# EAGLE design kuramoto6 (EAGLE 6.1)
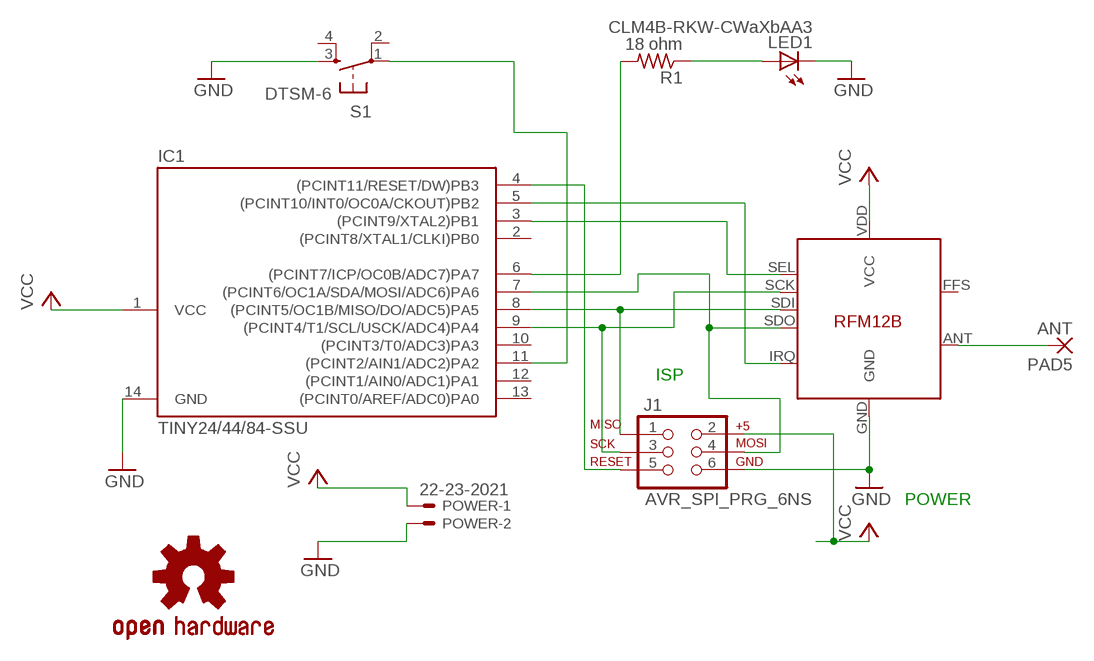
[diagram p0: schematic, sheet 1]

## Parts
IC1  TINY24/44/84-SSU  [SOIC14]
J1  AVR_SPI_PRG_6NS  [2X3-NS]
LED1  CLM4B-RKW-CWaXbAA3  LEDP-LCC-4  [P-LCC-4]
PAD5  ANT  WIREPAD2,54/1,0  [2,54/1,0]
POWER  22-23-2021  [22-23-2021]
R1  18 ohm  R-US_R0805  [R0805]
RFM12B  RFM12BN  [RFM12B-NARROW]
S1  DTSM-6  [DTSM-6]
U$1  OSHW-LOGOS  [OSHW-LOGO-S]

## Nets
GND: IC1.14(GND) J1.6 LED1.C@4(C) POWER.2 RFM12B.GND S1.3
N$1: LED1.A R1.1
N$2: IC1.9((PCINT4/T1/SCL/USCK/ADC4)PA4) J1.3 RFM12B.SCK
N$3: IC1.8((PCINT5/OC1B/MISO/DO/ADC5)PA5) J1.1 RFM12B.SDI
N$4: IC1.7((PCINT6/OC1A/SDA/MOSI/ADC6)PA6) J1.4 RFM12B.SDO
N$5: IC1.3((PCINT9/XTAL2)PB1) RFM12B.SEL
N$6: IC1.6((PCINT7/ICP/OC0B/ADC7)PA7) R1.2
N$7: IC1.5((PCINT10/INT0/OC0A/CKOUT)PB2) RFM12B.IRQ
N$8: PAD5.1(P) RFM12B.ANT
N$10: IC1.11((PCINT2/AIN1/ADC2)PA2) S1.1
N$14: IC1.4((PCINT11/RESET/DW)PB3) J1.5
VCC: IC1.1(VCC) J1.2 POWER.1 RFM12B.VDD(VCC)
Unconnected: IC1.2((PCINT8/XTAL1/CLKI)PB0) IC1.10((PCINT3/T0/ADC3)PA3) IC1.12((PCINT1/AIN0/ADC1)PA1) IC1.13((PCINT0/AREF/ADC0)PA0) RFM12B.FFS S1.2 S1.4

## Notes on the sheet
- ISP
- POWER

## Library data of the parts
IC1 = avr-7:TINY24/44/84
J1 = SparkFun-Connectors:AVR_SPI_PRG_6: AVR ISP 6 Pin This is the reduced ISP connector for AVR programming. Common on Arduino. This footprint will take up less PCB space and can be used with a 10-pin to 6-pin adapter such as SKU: BOB-08508
LED1 = led:LED: LED OSRAM: - CHIPLED LG R971, LG N971, LY N971, LG Q971, LY Q971, LO R971, LY R971 LH N974, LH R974 LS Q976, LO Q976, LY Q976 LO Q996 - Hyper CHIPLED LW Q18S LB Q993, LB Q99A, LB R99A - SideLED LS A670, LO A670, LY A670, LG A670, LP A670 LB A673, LV A673, LT A673, LW A673 LH A674 LY A675 LS A676, LA A676, LO A676, LY A676, LW A676 LS A679, LY A679, LG A679 - Hyper Micro SIDELED® LS Y876, LA Y876, LO Y876, LY Y876 LT Y87S - SmartLED LW L88C, LW L88S LB L89C, LB L89S, LG L890 LS L89K, LO L89K, LY L89K LS L896, LA L896, LO L896, LY L896 - TOPLED LS T670, LO T670, LY T670, LG T670, LP T670 LSG T670, LSP T670, LSY T670, LOP T670, LYG T670 LG T671, LOG T671, LSG T671 LB T673, LV T673, LT T673, LW T673 LH T674 LS T676, LA T676, LO T676, LY T676, LB T676, LH T676, LSB T676, LW T676 LB T67C, LV T67C, LT T67C, LS T67K, LO T67K, LY T67K, LW E67C LS E67B, LA E67B, LO E67B, LY E67B, LB E67C, LV E67C, LT E67C LW T67C LS T679, LY T679, LG T679 LS T770, LO T770, LY T770, LG T770, LP T770 LB T773, LV T773, LT T773, LW T773 LH T774 LS E675, LA E675, LY E675, LS T675 LS T776, LA T776, LO T776, LY T776, LB T776 LHGB T686 LT T68C, LB T68C - Hyper Mini TOPLED® LB M676 - Mini TOPLED Santana® LG M470 LS M47K, LO M47K, LY M47K Source: http://www.osram.convergy.de LUXEON: - LUMILED® LXK2-PW12-R00, LXK2-PW12-S00, LXK2-PW14-U00, LXK2-PW14-V00 LXK2-PM12-R00, LXK2-PM12-S00, LXK2-PM14-U00 LXK2-PE12-Q00, LXK2-PE12-R00, LXK2-PE12-S00, LXK2-PE14-T00, LXK2-PE14-U00 LXK2-PB12-K00, LXK2-PB12-L00, LXK2-PB12-M00, LXK2-PB14-N00, LXK2-PB14-P00, LXK2-PB14-Q00 LXK2-PR12-L00, LXK2-PR12-M00, LXK2-PR14-Q00, LXK2-PR14-R00 LXK2-PD12-Q00, LXK2-PD12-R00, LXK2-PD12-S00 LXK2-PH12-R00, LXK2-PH12-S00 LXK2-PL12-P00, LXK2-PL12-Q00, LXK2-PL12-R00 Source: www.luxeon.com KINGBRIGHT: KA-3528ASYC Source: www.kingbright.com
PAD5 = wirepad:WIREPAD: Wire PAD connect wire on PCB
POWER = con-molex:22-23-2021: .100" (2.54mm) Center Header - 2 Pin; MF: MOLEX; MPN: 22-23-2021; OC_FARNELL: 1462926; OC_NEWARK: 25C3832
R1 = resistor:R-US_: RESISTOR, American symbol
RFM12B = JeeLabs:RFM12B
S1 = switch-tact:DTSM-6
U$1 = sfe-aesthetics:OSHW-LOGO: Open Source Hardware Logo This logo indicates the piece of hardware it is found on incorporates a OSHW license and/or adheres to the definition of open source hardware found here: http://freedomdefined.org/OSHW

## Board
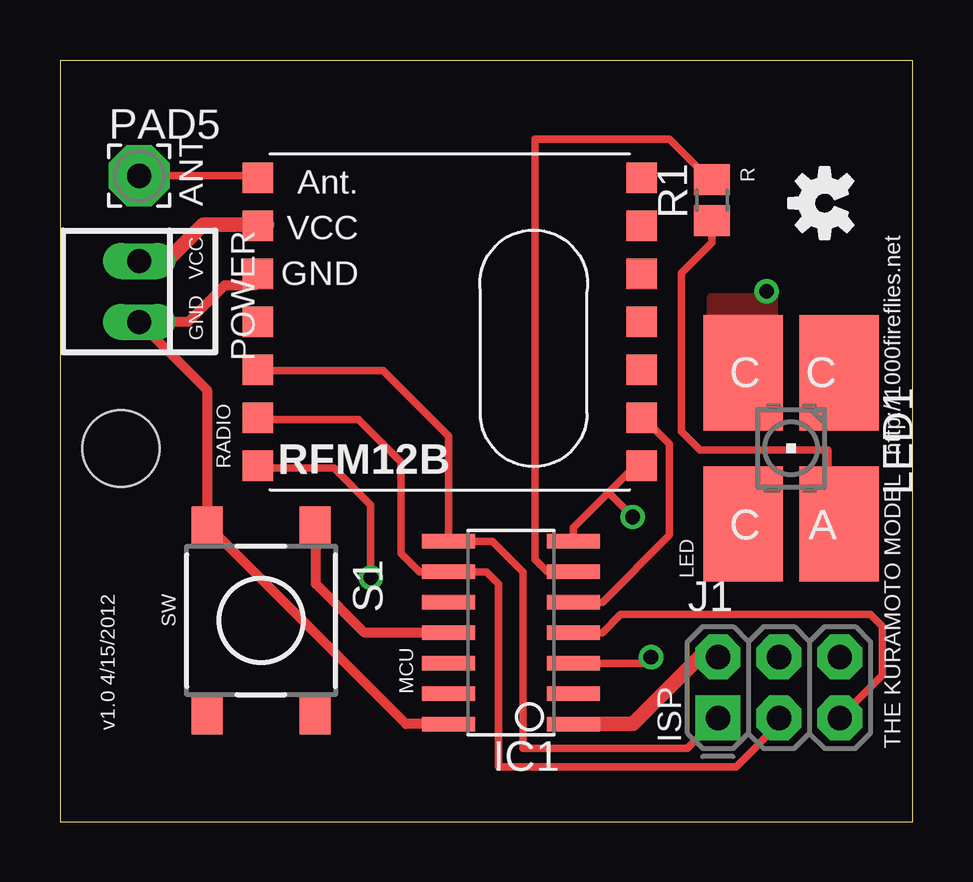
[diagram p1: board, top side]
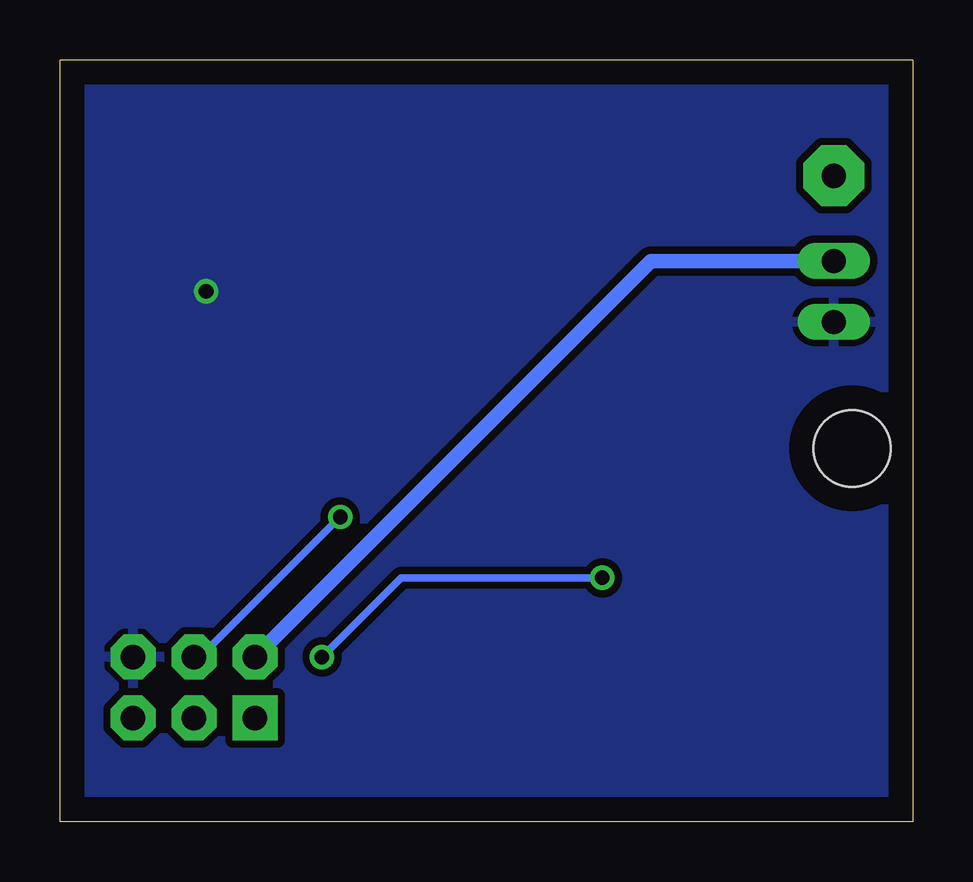
[diagram p2: board, bottom side, seen from below]

Size 35.56 x 31.75 mm. Coordinates in mm from the lower left corner, seen from the top.
Outline: 0,0 35.56,0 35.56,31.75 0,31.75 0,0
Copper layers (1*16): Top 0.035mm / dielectric 1.5mm / Bottom 0.035mm
Design rules: minimum track width 12mil, minimum drill 24mil, track to track 12mil, track to pad 12mil, pad to pad 12mil, via to via 12mil, smd to smd 8mil, copper to edge 40mil, drill to drill 8mil, minimum pad ring 10mil, minimum via ring 8mil, stop-mask expansion 4mil, vias tented up to drill 0mil, thermal gap 10mil
Holes 3.2 mm at 2.54,15.56
tKeepout: area 0,0 to 35.6,3.3; area 0,28.4 to 35.6,31.8

### Footprints (pad centres in the part's own frame; a part is rotated, then mirrored left to right if it is on the bottom)
SOIC14 = smd 0.61 x 2.21: 1 -3.81,-2.603; 2 -2.54,-2.603; 3 -1.27,-2.603; 4 0,-2.603; 5 1.27,-2.603; 6 2.54,-2.603; 7 3.81,-2.603; 8 3.81,2.603; 9 2.54,2.603; 10 1.27,2.603; 11 0,2.603; 12 -1.27,2.603; 13 -2.54,2.603; 14 -3.81,2.603
2X3-NS = drill 1.016 pad 1.88 square: 1 -2.54,-1.27 | drill 1.016 pad 1.88 octagon: 2 -2.54,1.27; 3 0,-1.27; 4 0,1.27; 5 2.54,-1.27; 6 2.54,1.27
P-LCC-4 = smd 3.3 x 4.8: A -2,3.15; C@1 -2,-3.15; C@3 2,3.15; C@4 2,-3.15
2,54/1,0 = drill 1.016 pad 2.54 octagon: 1 0,0
22-23-2021 = drill 1 long: 1 -1.27,0; 2 1.27,0
R0805 = smd 1.3 x 1.5: 1 -0.85,0; 2 0.85,0
RFM12B-NARROW = smd 1.27 x 1.27: ANT 8,-6; FFS -8,2; GND 8,-2; IRQ -8,4; P$8 -8,0; P$9 -8,-2; P$10 -8,-4; P$12 -8,-6; P$16 8,0; SCK 8,4; SDI 8,2; SDO -8,6; SEL 8,6; VDD 8,-4
DTSM-6 = smd 1.55 x 1.3: 1 -3.975,2.25; 2 3.975,2.25; 3 -3.975,-2.25; 4 3.975,-2.25

### Placement (x,y rotation side)
IC1  18.8,7.87 90 top
J1  29.97,5.59 0 top
LED1  30.48,15.56 180 top
PAD5  3.3,26.92 0 top
POWER  3.3,22.1 270 top
R1  27.18,25.91 90 top
RFM12B  16.26,20.83 180 top
S1  8.38,8.38 270 top
U$1  31.88,25.78 90 top

### Tracks (layer width: path | path; a pad name or v marks a point on that pad's centre or on a via)
GND  (via drill 0.61)
  Top 0.305: 8.64,22.86 RFM12B.GND 8.13,22.35 | v29.46,22.1 29.46,21.84 29.72,21.84
  Top 0.406: POWER.2 3.68,20.45 | 3.68,20.45 6.13,18 S1.3 14.43,4.06 IC1.14 | 8.13,22.35 6.86,22.35 5.33,20.83 4.06,20.83 3.68,20.45
  pour Bottom: 0.51,0.51 35.05,0.51 35.05,31.24 0.51,31.24
  pour Top (no thermals): 27.18,21.84 29.72,21.84 29.72,20.32 27.18,20.32
N$1
  Top 0.305: LED1.A 32,12.7 32,15.49 26.67,15.49 25.91,16.26 25.91,22.86 27.18,24.13 R1.1
N$2
  Top 0.305: RFM12B.SCK 8.64,16.76 12.45,16.76 14.22,14.99 14.22,11.18 14.99,10.41 IC1.9 17.78,10.41 18.29,9.91 18.29,2.29 28.19,2.29 29.97,4.06 J1.3
N$3
  Top 0.305: J1.1 26.16,3.05 19.3,3.05 19.3,10.41 18.03,11.68 IC1.8 16.19,16.07 13.46,18.8 8.29,18.8 RFM12B.SDI
N$4  (via drill 0.61)
  Top 0.305: 22.86,13.72 21.4,12.26 IC1.7 | 22.86,13.72 23.88,14.73 RFM12B.SDO | v23.88,12.7 22.86,13.72
  Bottom 0.305: J1.4 29.72,6.86 v23.88,12.7
N$5  (via drill 0.61)
  Top 0.305: RFM12B.SEL 8.64,14.73 11.43,14.73 12.95,13.21 v12.95,10.16 | IC1.3 24.38,6.6 v24.64,6.86
  Bottom 0.305: v12.95,10.16 21.34,10.16 v24.64,6.86
N$6
  Top 0.305: R1.2 27.09,26.76 25.4,28.45 19.81,28.45 19.81,10.92 20.32,10.41 IC1.6
N$7
  Top 0.305: RFM12B.IRQ 24.38,16.76 25.4,15.75 25.4,11.94 22.61,9.14 IC1.5
N$8
  Top 0.305: PAD5.1 8.13,26.92 RFM12B.ANT
N$10
  Top 0.406: S1.1 10.67,12.32 10.67,9.91 12.7,7.87 IC1.11
N$14
  Top 0.305: IC1.4 22.61,7.87 23.37,8.64 33.78,8.64 34.29,8.13 34.29,6.1 J1.5
VCC
  Top 0.305: 8.64,24.89 RFM12B.VDD
  Top 0.61: 8.64,24.89 5.97,24.89 4.45,23.37 POWER.1 | IC1.1 23.88,4.06 26.67,6.86 J1.2
  Bottom 0.61: 27.43,7.37 J1.2 10.92,23.37 POWER.1

### Text on the board
tPlace: R | ANT | VCC | GND | RADIO | LED | SW | MCU | v1.0 4/15/2012 | ISP | THE KURAMOTO MODEL | http://1000fireflies.net